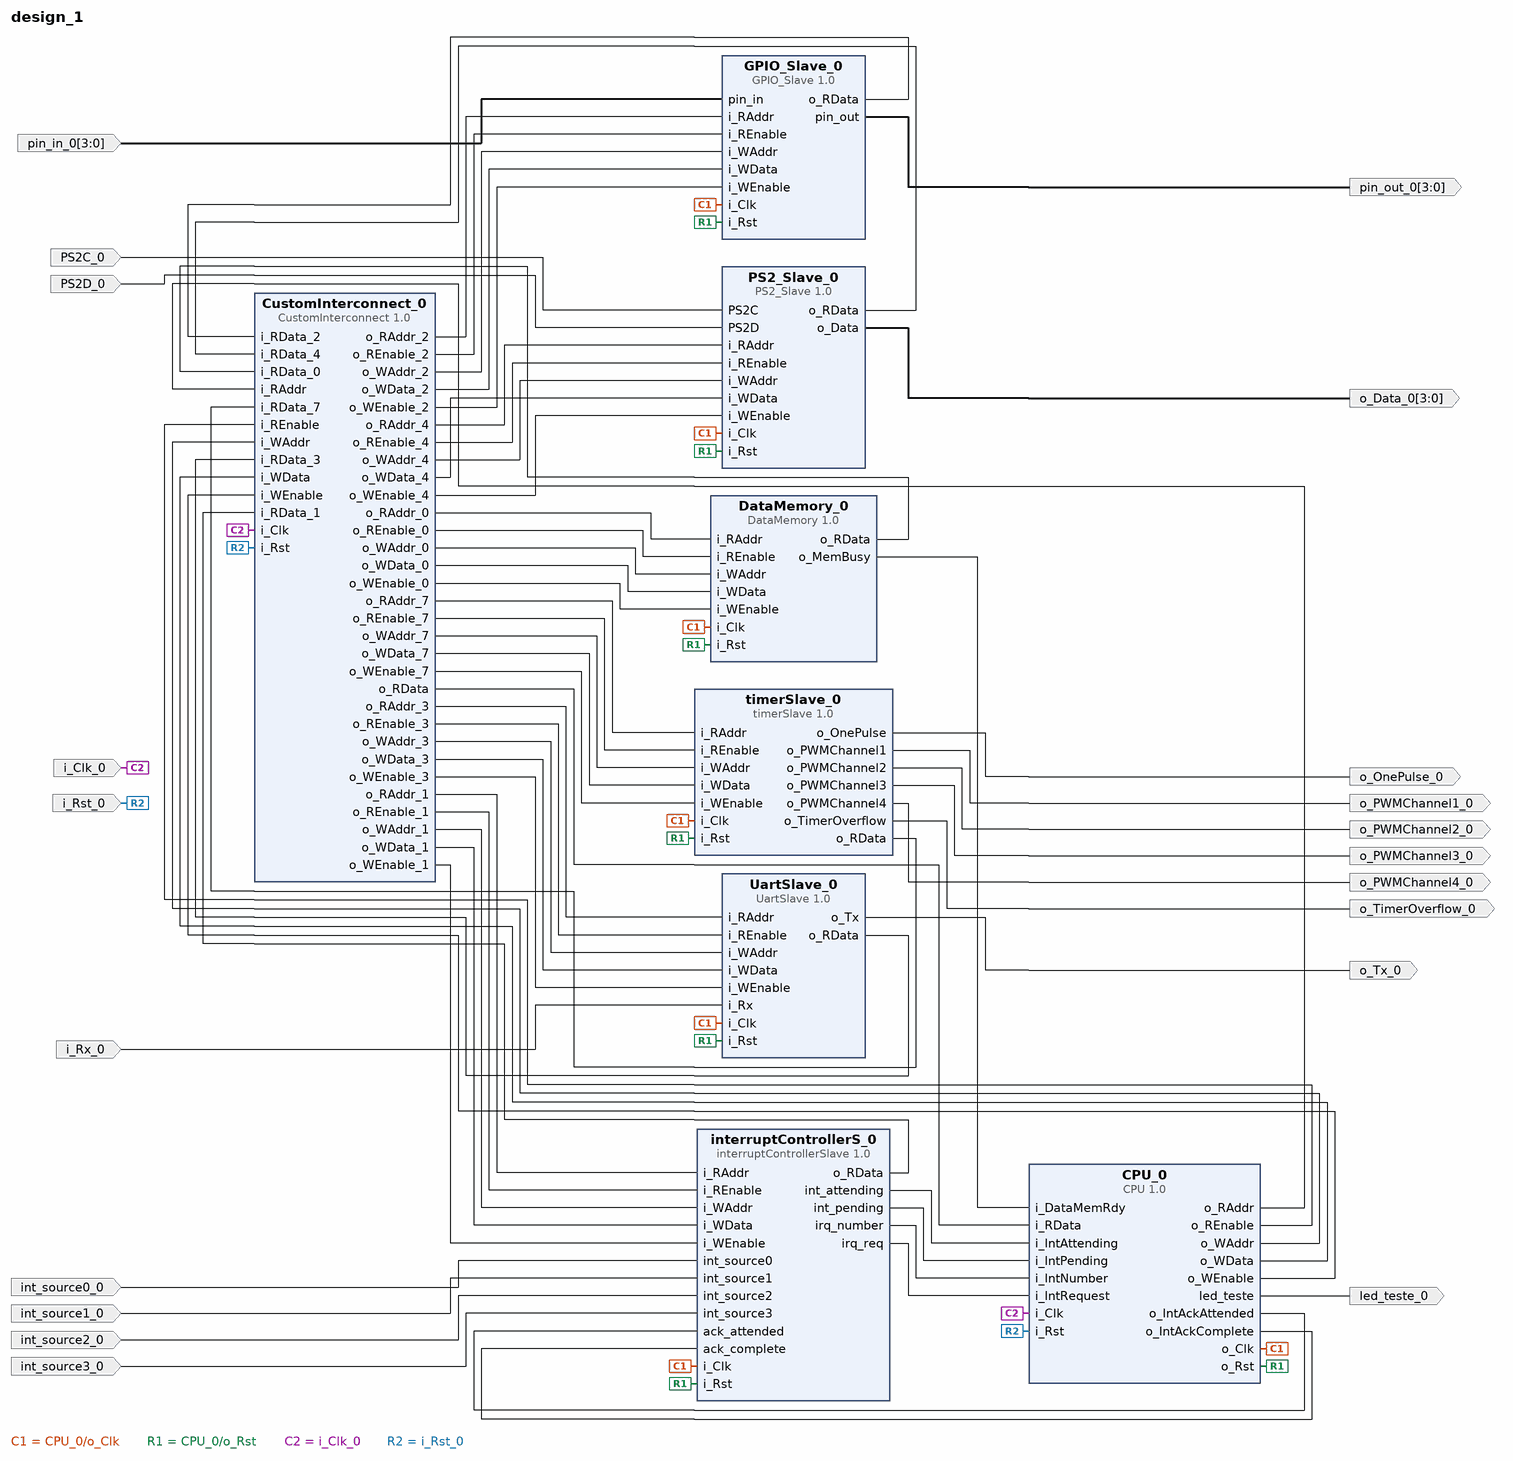
[diagram p0: block diagram of the top level]
# Vivado block design design_1, xc7z010clg400-1, Vivado 2023.1
create_bd_design design_1

create_bd_port -dir O o_Tx_0
create_bd_port -dir O -from 3 -to 0 o_Data_0
create_bd_port -dir I i_Rx_0
create_bd_port -dir I PS2C_0
create_bd_port -dir I PS2D_0
create_bd_port -dir O o_TimerOverflow_0
create_bd_port -dir O o_PWMChannel1_0
create_bd_port -dir O o_PWMChannel2_0
create_bd_port -dir O o_PWMChannel3_0
create_bd_port -dir O o_PWMChannel4_0
create_bd_port -dir O o_OnePulse_0
create_bd_port -dir I -type clk i_Clk_0
create_bd_port -dir I -type rst i_Rst_0
create_bd_port -dir I int_source3_0
create_bd_port -dir I int_source2_0
create_bd_port -dir I int_source1_0
create_bd_port -dir I int_source0_0
create_bd_port -dir O led_teste_0
create_bd_port -dir O -from 3 -to 0 pin_out_0
create_bd_port -dir I -from 3 -to 0 pin_in_0

create_bd_cell -type ip -vlnv user.org:user:PS2_Slave:1.0 PS2_Slave_0
create_bd_cell -type ip -vlnv user.org:user:timerSlave:1.0 timerSlave_0
create_bd_cell -type ip -vlnv user.org:user:DataMemory:1.0 DataMemory_0
create_bd_cell -type ip -vlnv user.org:user:UartSlave:1.0 UartSlave_0
create_bd_cell -type ip -vlnv user.org:user:CustomInterconnect:1.0 CustomInterconnect_0
create_bd_cell -type ip -vlnv user.org:user:interruptControllerSlave:1.0 interruptControllerS_0
create_bd_cell -type ip -vlnv user.org:user:GPIO_Slave:1.0 GPIO_Slave_0
create_bd_cell -type ip -vlnv user.org:user:CPU:1.0 CPU_0

# ---- connections ----

connect_bd_net [get_bd_pins CPU_0/led_teste] [get_bd_ports led_teste_0]
connect_bd_net [get_bd_pins CPU_0/o_IntAckAttended] [get_bd_pins interruptControllerS_0/ack_attended]
connect_bd_net [get_bd_pins CPU_0/o_IntAckComplete] [get_bd_pins interruptControllerS_0/ack_complete]
connect_bd_net [get_bd_pins CPU_0/o_RAddr] [get_bd_pins CustomInterconnect_0/i_RAddr]
connect_bd_net [get_bd_pins CPU_0/o_REnable] [get_bd_pins CustomInterconnect_0/i_REnable]
connect_bd_net [get_bd_pins CPU_0/o_WAddr] [get_bd_pins CustomInterconnect_0/i_WAddr]
connect_bd_net [get_bd_pins CPU_0/o_WData] [get_bd_pins CustomInterconnect_0/i_WData]
connect_bd_net [get_bd_pins CPU_0/o_WEnable] [get_bd_pins CustomInterconnect_0/i_WEnable]
connect_bd_net -net CPU_1_o_Clk [get_bd_pins CPU_0/o_Clk] \
  [get_bd_pins PS2_Slave_0/i_Clk] [get_bd_pins timerSlave_0/i_Clk] [get_bd_pins DataMemory_0/i_Clk] \
  [get_bd_pins UartSlave_0/i_Clk] [get_bd_pins interruptControllerS_0/i_Clk] [get_bd_pins GPIO_Slave_0/i_Clk]
connect_bd_net -net CPU_1_o_Rst [get_bd_pins CPU_0/o_Rst] \
  [get_bd_pins PS2_Slave_0/i_Rst] [get_bd_pins timerSlave_0/i_Rst] [get_bd_pins DataMemory_0/i_Rst] \
  [get_bd_pins UartSlave_0/i_Rst] [get_bd_pins interruptControllerS_0/i_Rst] [get_bd_pins GPIO_Slave_0/i_Rst]
connect_bd_net [get_bd_pins CustomInterconnect_0/o_RAddr_0] [get_bd_pins DataMemory_0/i_RAddr]
connect_bd_net [get_bd_pins CustomInterconnect_0/o_RAddr_1] [get_bd_pins interruptControllerS_0/i_RAddr]
connect_bd_net [get_bd_pins CustomInterconnect_0/o_RAddr_2] [get_bd_pins GPIO_Slave_0/i_RAddr]
connect_bd_net [get_bd_pins CustomInterconnect_0/o_RAddr_3] [get_bd_pins UartSlave_0/i_RAddr]
connect_bd_net [get_bd_pins CustomInterconnect_0/o_RAddr_4] [get_bd_pins PS2_Slave_0/i_RAddr]
connect_bd_net [get_bd_pins CustomInterconnect_0/o_RAddr_7] [get_bd_pins timerSlave_0/i_RAddr]
connect_bd_net [get_bd_pins CustomInterconnect_0/o_RData] [get_bd_pins CPU_0/i_RData]
connect_bd_net [get_bd_pins CustomInterconnect_0/o_REnable_0] [get_bd_pins DataMemory_0/i_REnable]
connect_bd_net [get_bd_pins CustomInterconnect_0/o_REnable_1] [get_bd_pins interruptControllerS_0/i_REnable]
connect_bd_net [get_bd_pins CustomInterconnect_0/o_REnable_2] [get_bd_pins GPIO_Slave_0/i_REnable]
connect_bd_net [get_bd_pins CustomInterconnect_0/o_REnable_3] [get_bd_pins UartSlave_0/i_REnable]
connect_bd_net [get_bd_pins CustomInterconnect_0/o_REnable_4] [get_bd_pins PS2_Slave_0/i_REnable]
connect_bd_net [get_bd_pins CustomInterconnect_0/o_REnable_7] [get_bd_pins timerSlave_0/i_REnable]
connect_bd_net [get_bd_pins CustomInterconnect_0/o_WAddr_0] [get_bd_pins DataMemory_0/i_WAddr]
connect_bd_net [get_bd_pins CustomInterconnect_0/o_WAddr_1] [get_bd_pins interruptControllerS_0/i_WAddr]
connect_bd_net [get_bd_pins CustomInterconnect_0/o_WAddr_2] [get_bd_pins GPIO_Slave_0/i_WAddr]
connect_bd_net [get_bd_pins CustomInterconnect_0/o_WAddr_3] [get_bd_pins UartSlave_0/i_WAddr]
connect_bd_net [get_bd_pins CustomInterconnect_0/o_WAddr_4] [get_bd_pins PS2_Slave_0/i_WAddr]
connect_bd_net [get_bd_pins CustomInterconnect_0/o_WAddr_7] [get_bd_pins timerSlave_0/i_WAddr]
connect_bd_net [get_bd_pins CustomInterconnect_0/o_WData_0] [get_bd_pins DataMemory_0/i_WData]
connect_bd_net [get_bd_pins CustomInterconnect_0/o_WData_1] [get_bd_pins interruptControllerS_0/i_WData]
connect_bd_net [get_bd_pins CustomInterconnect_0/o_WData_2] [get_bd_pins GPIO_Slave_0/i_WData]
connect_bd_net [get_bd_pins CustomInterconnect_0/o_WData_3] [get_bd_pins UartSlave_0/i_WData]
connect_bd_net [get_bd_pins CustomInterconnect_0/o_WData_4] [get_bd_pins PS2_Slave_0/i_WData]
connect_bd_net [get_bd_pins CustomInterconnect_0/o_WData_7] [get_bd_pins timerSlave_0/i_WData]
connect_bd_net [get_bd_pins CustomInterconnect_0/o_WEnable_0] [get_bd_pins DataMemory_0/i_WEnable]
connect_bd_net [get_bd_pins CustomInterconnect_0/o_WEnable_1] [get_bd_pins interruptControllerS_0/i_WEnable]
connect_bd_net [get_bd_pins CustomInterconnect_0/o_WEnable_2] [get_bd_pins GPIO_Slave_0/i_WEnable]
connect_bd_net [get_bd_pins CustomInterconnect_0/o_WEnable_3] [get_bd_pins UartSlave_0/i_WEnable]
connect_bd_net [get_bd_pins CustomInterconnect_0/o_WEnable_4] [get_bd_pins PS2_Slave_0/i_WEnable]
connect_bd_net [get_bd_pins CustomInterconnect_0/o_WEnable_7] [get_bd_pins timerSlave_0/i_WEnable]
connect_bd_net [get_bd_pins DataMemory_0/o_MemBusy] [get_bd_pins CPU_0/i_DataMemRdy]
connect_bd_net [get_bd_pins DataMemory_0/o_RData] [get_bd_pins CustomInterconnect_0/i_RData_0]
connect_bd_net [get_bd_pins GPIO_Slave_0/o_RData] [get_bd_pins CustomInterconnect_0/i_RData_2]
connect_bd_net [get_bd_pins GPIO_Slave_0/pin_out] [get_bd_ports pin_out_0]
connect_bd_net -net PS2C_0_1 [get_bd_ports PS2C_0] [get_bd_pins PS2_Slave_0/PS2C]
connect_bd_net -net PS2D_0_1 [get_bd_ports PS2D_0] [get_bd_pins PS2_Slave_0/PS2D]
connect_bd_net [get_bd_pins PS2_Slave_0/o_Data] [get_bd_ports o_Data_0]
connect_bd_net [get_bd_pins PS2_Slave_0/o_RData] [get_bd_pins CustomInterconnect_0/i_RData_4]
connect_bd_net [get_bd_pins UartSlave_0/o_RData] [get_bd_pins CustomInterconnect_0/i_RData_3]
connect_bd_net [get_bd_pins UartSlave_0/o_Tx] [get_bd_ports o_Tx_0]
connect_bd_net -net i_Clk_0_1 [get_bd_ports i_Clk_0] [get_bd_pins CustomInterconnect_0/i_Clk] [get_bd_pins CPU_0/i_Clk]
connect_bd_net -net i_Rst_0_1 [get_bd_ports i_Rst_0] [get_bd_pins CustomInterconnect_0/i_Rst] [get_bd_pins CPU_0/i_Rst]
connect_bd_net -net i_Rx_0_1 [get_bd_ports i_Rx_0] [get_bd_pins UartSlave_0/i_Rx]
connect_bd_net -net int_source0_0_1 [get_bd_ports int_source0_0] [get_bd_pins interruptControllerS_0/int_source0]
connect_bd_net -net int_source1_0_1 [get_bd_ports int_source1_0] [get_bd_pins interruptControllerS_0/int_source1]
connect_bd_net -net int_source2_0_1 [get_bd_ports int_source2_0] [get_bd_pins interruptControllerS_0/int_source2]
connect_bd_net -net int_source3_0_1 [get_bd_ports int_source3_0] [get_bd_pins interruptControllerS_0/int_source3]
connect_bd_net [get_bd_pins interruptControllerS_0/int_attending] [get_bd_pins CPU_0/i_IntAttending]
connect_bd_net [get_bd_pins interruptControllerS_0/int_pending] [get_bd_pins CPU_0/i_IntPending]
connect_bd_net [get_bd_pins interruptControllerS_0/irq_number] [get_bd_pins CPU_0/i_IntNumber]
connect_bd_net [get_bd_pins interruptControllerS_0/irq_req] [get_bd_pins CPU_0/i_IntRequest]
connect_bd_net [get_bd_pins interruptControllerS_0/o_RData] [get_bd_pins CustomInterconnect_0/i_RData_1]
connect_bd_net -net pin_in_0_1 [get_bd_ports pin_in_0] [get_bd_pins GPIO_Slave_0/pin_in]
connect_bd_net [get_bd_pins timerSlave_0/o_OnePulse] [get_bd_ports o_OnePulse_0]
connect_bd_net [get_bd_pins timerSlave_0/o_PWMChannel1] [get_bd_ports o_PWMChannel1_0]
connect_bd_net [get_bd_pins timerSlave_0/o_PWMChannel2] [get_bd_ports o_PWMChannel2_0]
connect_bd_net [get_bd_pins timerSlave_0/o_PWMChannel3] [get_bd_ports o_PWMChannel3_0]
connect_bd_net [get_bd_pins timerSlave_0/o_PWMChannel4] [get_bd_ports o_PWMChannel4_0]
connect_bd_net [get_bd_pins timerSlave_0/o_RData] [get_bd_pins CustomInterconnect_0/i_RData_7]
connect_bd_net [get_bd_pins timerSlave_0/o_TimerOverflow] [get_bd_ports o_TimerOverflow_0]

validate_bd_design
save_bd_design
